# EAGLE design buttons (EAGLE 7.3.0)
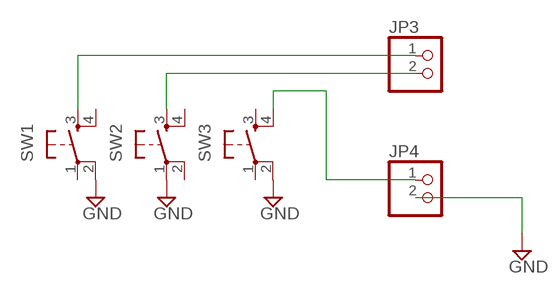
[diagram p0: schematic, sheet 1]

## Parts
JP3  PINHD-1X2  [1X02]
JP4  PINHD-1X2  [1X02]
SW1  ALPS-4.2X3.2MM  [ALPS-4.2X3.2MM]
SW2  ALPS-4.2X3.2MM  [ALPS-4.2X3.2MM]
SW3  ALPS-4.2X3.2MM  [ALPS-4.2X3.2MM]

## Nets
GND [power]: JP4.2 SW1.2(P1) SW2.1(P) SW3.2(P1)
N$1: JP3.1 SW1.3(S)
N$2: JP3.2 SW2.3(S)
N$3: JP4.1 SW3.4(S1)
Unconnected: SW1.1(P) SW1.4(S1) SW2.2(P1) SW2.4(S1) SW3.1(P) SW3.3(S)

## Library data of the parts
JP3 JP4 = pinhead:PINHD-1X2: PIN HEADER
SW1-SW3 = switch-custom:ALPS-4.2X3.2MM

## Net classes
2 power: width 0.61 mm, drill 0.305 mm, clearance 0.254 mm

## Board
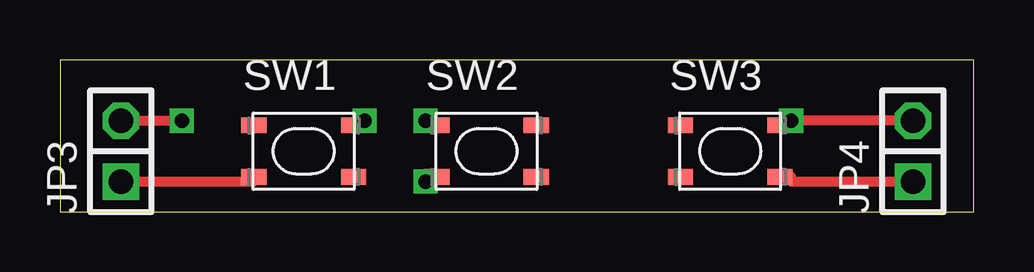
[diagram p1: board, top side]
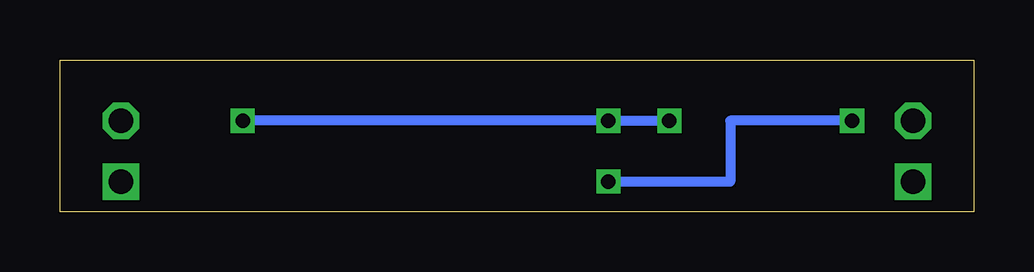
[diagram p2: board, bottom side, seen from below]

Size 38.1 x 6.35 mm. Coordinates in mm from the lower left corner, seen from the top.
Outline: 0,0 38.1,0 38.1,6.35 0,6.35 0,0
Copper layers (1*16): Top 0.035mm / dielectric 1.5mm / Bottom 0.035mm
Design rules "default": minimum track width 10mil, minimum drill 24mil, track to track 8mil, track to pad 8mil, pad to pad 8mil, via to via 8mil, smd to smd 8mil, copper to edge 40mil, drill to drill 8mil, minimum pad ring 10mil, minimum via ring 8mil, stop-mask expansion 4mil, vias tented up to drill 0mil, thermal gap 10mil

### Footprints (pad centres in the part's own frame; a part is rotated, then mirrored left to right if it is on the bottom)
1X02 = drill 1.016 square: 1 -1.27,0 | drill 1.016 octagon: 2 1.27,0
ALPS-4.2X3.2MM = smd 1.05 x 0.65: 1 -2.075,1.075; 2 2.075,1.075; 3 -2.075,-1.075; 4 2.075,-1.075

### Placement (x,y rotation side)
JP3  2.54,2.54 90 top
JP4  35.56,2.54 90 top
SW1  10.16,2.54 0 top
SW2  17.78,2.54 0 top
SW3  27.94,2.54 0 top

### Tracks (layer width: path | path; a pad name or v marks a point on that pad's centre or on a via)
GND  (via drill 0.6)
  Top 0.406: SW3.2 30.48,3.61 v30.48,3.81 JP4.2 | SW1.2 12.7,3.61 v12.7,3.81 | SW2.1 15.24,3.61 v15.24,3.81
  Bottom 0.406: v12.7,3.81 v15.24,3.81 v30.48,3.81
N$1
  Top 0.406: JP3.1 8.09,1.27 SW1.3
N$2  (via drill 0.6)
  Top 0.406: JP3.2 v5.08,3.81 | SW2.3 15.24,1.46 v15.24,1.27
  Bottom 0.406: v5.08,3.81 10.16,3.81 10.16,1.27 v15.24,1.27
N$3
  Top 0.406: SW3.4 30.48,1.46 30.48,1.27 JP4.1